# EAGLE design rj45WingEth (EAGLE 9.6.0)
COMPANY: ADAFRUIT INDUSTRIES; DRAWN: KTOWN; REV: B
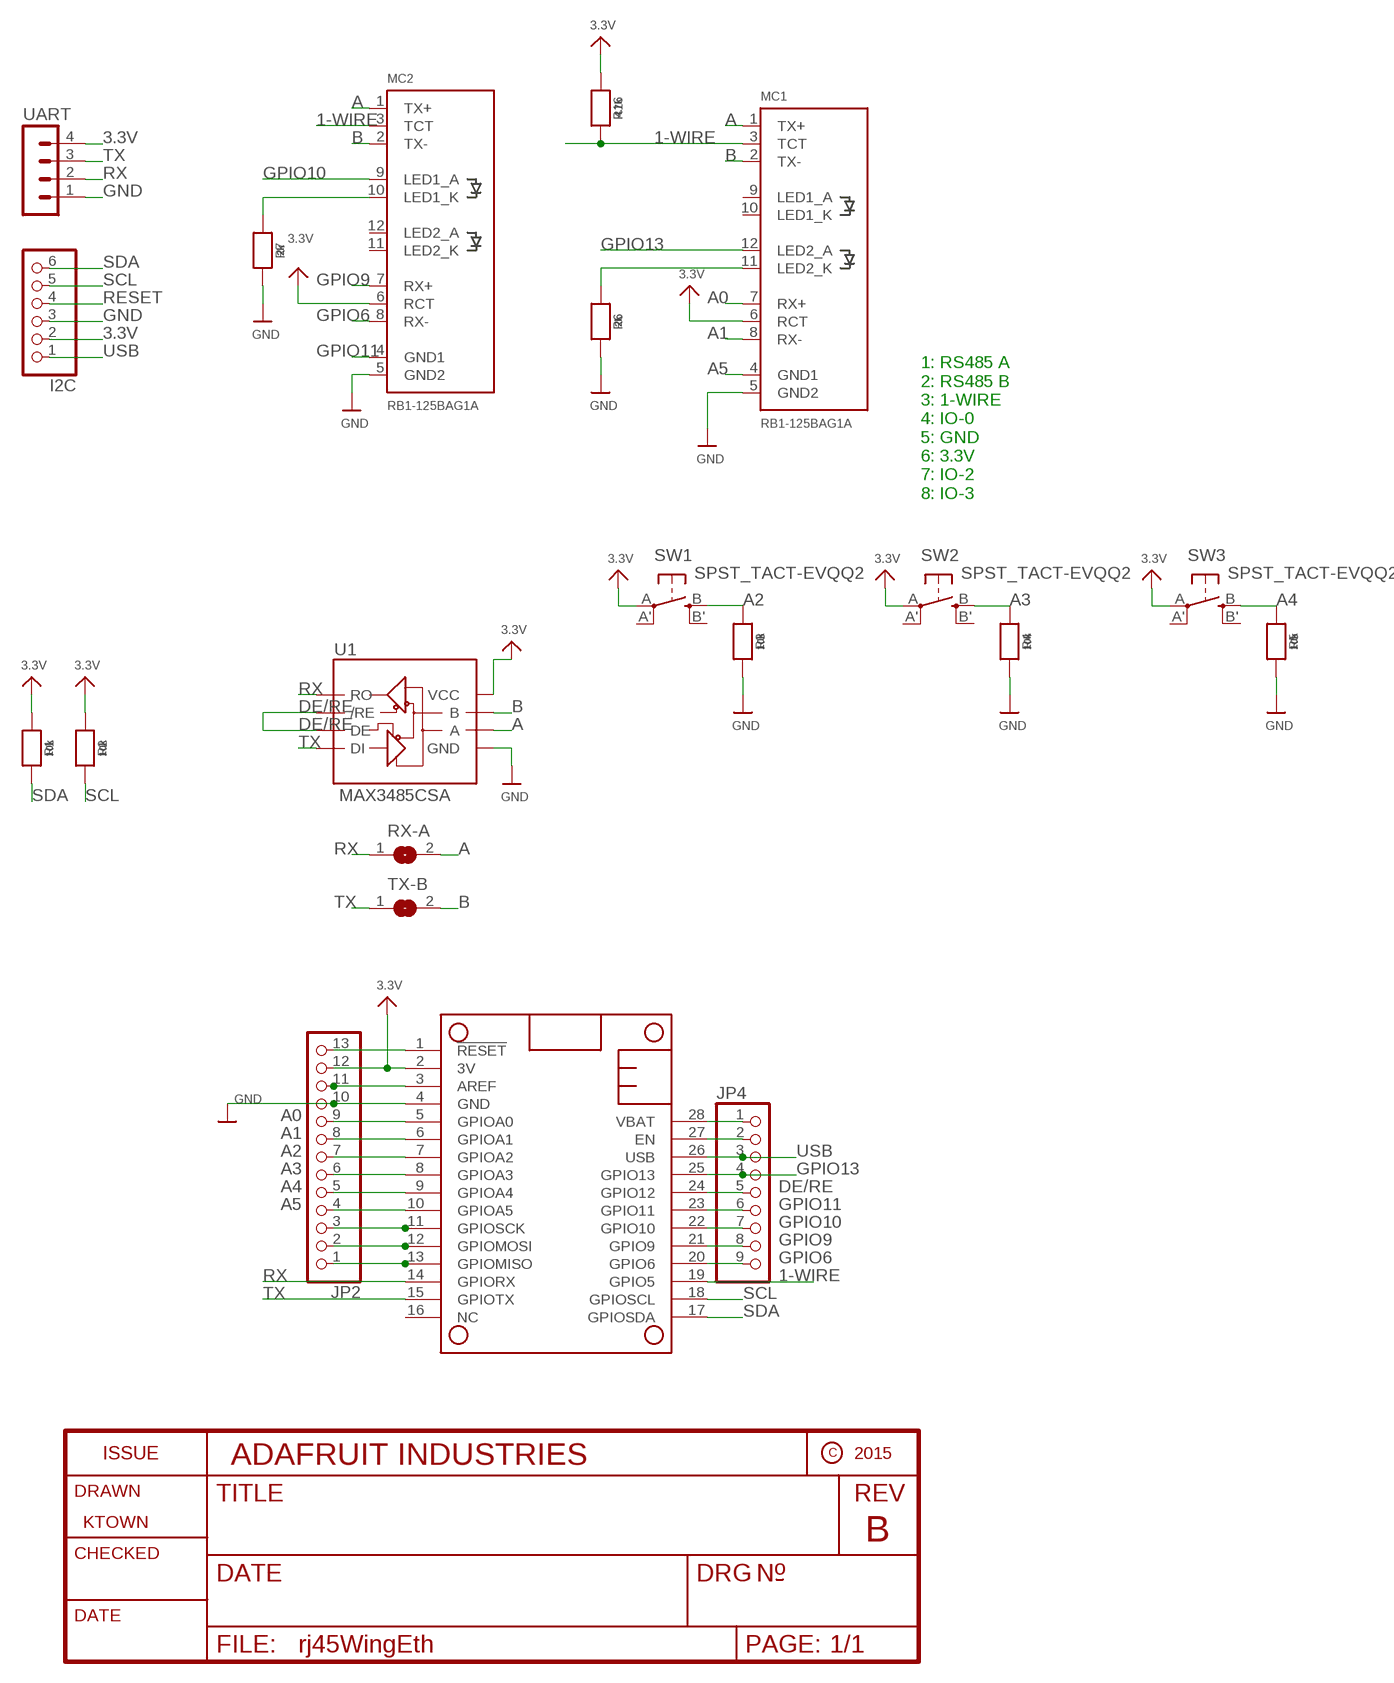
[diagram p0: schematic, sheet 1]

## Parts
I2C  PINHD-1X6  [1X06]
JP2  HEADER-1X13  [1X13_ROUND_70]
JP4  HEADER-1X970MIL  [1X09_ROUND_70]
MC1  RB1-125BAG1A  RJ45J0026D21BNL  [RJ45_PULSEJACK]
MC2  RB1-125BAG1A  RJ45J0026D21BNL  [RJ45_PULSEJACK]
MS1  FEATHERWING_NODIM  [FEATHERWING_NODIM]
R1  10k  RESISTOR_0603_NOOUT  [0603-NO]
R2  10k  RESISTOR_0603_NOOUT  [0603-NO]
R3  10k  RESISTOR_0603_NOOUT  [0603-NO]
R4  10k  RESISTOR_0603_NOOUT  [0603-NO]
R5  10k  RESISTOR_0603_NOOUT  [0603-NO]
R6  2k  RESISTOR_0603_NOOUT  [0603-NO]
R7  2k  RESISTOR_0603_NOOUT  [0603-NO]
R16  4.7k  RESISTOR_0603_NOOUT  [0603-NO]
RX-A  SJ  [SJ]
SW1  SPST_TACT-EVQQ2  [EVQ-Q2]
SW2  SPST_TACT-EVQQ2  [EVQ-Q2]
SW3  SPST_TACT-EVQQ2  [EVQ-Q2]
TX-B  SJ  [SJ]
U1  MAX3485CSA  RS485SOIC  [SO08]
UART  MA04-1  [MA04-1]

## Nets
1-WIRE: MC1.3(TCT) MC2.3(TCT) MS1.19(GPIO5) R16.2
3.3V: I2C.2 JP2.12 MC1.6(RCT) MC2.6(RCT) MS1.2(3V) R1.1 R2.1 R16.1 SW1.A(P) SW2.A(P) SW3.A(P) U1.8(VCC) UART.4
A: MC1.1(TX+) MC2.1(TX+) RX-A.2 U1.6(A)
A0: JP2.9 MC1.7(RX+) MS1.5(GPIOA0)
A1: JP2.8 MC1.8(RX-) MS1.6(GPIOA1)
A2: JP2.7 MS1.7(GPIOA2) R3.1 SW1.B(S)
A3: JP2.6 MS1.8(GPIOA3) R4.1 SW2.B(S)
A4: JP2.5 MS1.9(GPIOA4) R5.1 SW3.B(S)
A5: JP2.4 MC1.4(GND1) MS1.10(GPIOA5)
B: MC1.2(TX-) MC2.2(TX-) TX-B.2 U1.7(B)
DE/RE: JP4.5 MS1.24(GPIO12) U1.2(/RE) U1.3(DE)
GND: I2C.3 JP2.10 MC1.5(GND2) MC2.5(GND2) MS1.4(GND) R3.2 R4.2 R5.2 R6.2 R7.2 U1.5(GND) UART.1
GPIO6: JP4.9 MC2.8(RX-) MS1.20(GPIO6)
GPIO9: JP4.8 MC2.7(RX+) MS1.21(GPIO9)
GPIO10: JP4.7 MC2.9(LED1_A) MS1.22(GPIO10)
GPIO11: JP4.6 MC2.4(GND1) MS1.23(GPIO11)
GPIO13: JP4.4 MC1.12(LED2_A) MS1.25(GPIO13)
MISO_MCU: JP2.1 MS1.13(GPIOMISO)
MOSI: JP2.2 MS1.12(GPIOMOSI)
N$1: MC1.11(LED2_K) R6.1
N$3: MC2.10(LED1_K) R7.1
N$15: JP4.2 MS1.27(EN)
N$22: JP2.13 MS1.1(!RESET)
N$34: JP2.11 MS1.3(AREF)
RESET: I2C.4
RX: MS1.14(GPIORX) RX-A.1 U1.1(RO) UART.2
SCK: JP2.3 MS1.11(GPIOSCK)
SCL: I2C.5 MS1.18(GPIOSCL) R2.2
SDA: I2C.6 MS1.17(GPIOSDA) R1.2
TX: MS1.15(GPIOTX) TX-B.1 U1.4(DI) UART.3
USB: I2C.1 JP4.3 MS1.26(USB)
VBAT: JP4.1 MS1.28(VBAT)
Unconnected: MC1.9(LED1_A) MC1.10(LED1_K) MC2.11(LED2_K) MC2.12(LED2_A) MS1.16(NC) SW1.A'(P1) SW1.B'(S1) SW2.A'(P1) SW2.B'(S1) SW3.A'(P1) SW3.B'(S1)

## Notes on the sheet
- 1: RS485 A
  2: RS485 B
  3: 1-WIRE
  4: IO-0
  5: GND
  6: 3.3V
  7: IO-2
  8: IO-3

## Library data of the parts
I2C = adafruit:PINHD-1X6: PIN HEADER
JP2 = microbuilder:HEADER-1X13
JP4 = microbuilder:HEADER-1X9: PIN HEADER
MC1 MC2 = microbuilder:RJ45: RJ45 (Ethernet) Connectors J0026D21BNL - RJ45 Connector with internal transformer and 2 LEDs (Yellow/Green). LEDs have max foreward-voltage of 2.5V. LEDs require an external resistor. Digikey: 553-1349-ND J00-0065NL - RJ45 Connector with internal transformer and 2 LEDs (Yellow/Green). LEDs have max foreward-voltage of 2.5V. LEDs require an external resistor. Digikey: 553-1345-ND
MS1 = microbuilder:FEATHERWING
R1-R7 R16 = microbuilder:RESISTOR: Resistors For new designs, use the packages preceded by an '_' character since they are more reliable: The following footprints should be used on most boards: _0402 - Standard footprint for regular board layouts _0603 - Standard footprint for regular board layouts _0805 - Standard footprint for regular board layouts _1206 - Standard footprint for regular board layouts For extremely tight-pitch boards where space is at a premium, the following 'micro-pitch' footprints can be used (smaller pads, no silkscreen outline, etc.): _0402MP - Micro-pitch footprint for very dense/compact boards _0603MP - Micro-pitch footprint for very dense/compact boards _0805MP - Micro-pitch footprint for very dense/compact boards _1206MP - Micro-pitch footprint for very dense/compact boards
RX-A TX-B = jumper:SJ: SMD solder JUMPER
SW1-SW3 = adafruit:SPST_TACT: SMT 6mm switch, EVQQ2 series http://www.ladyada.net/library/eagle
U1 = SparkFun-IC-Comms:RS485: RS-485 Transceiver SP3485 Series 8 Pin NSOIC 3.3 V Low Power Half Duplex RS-485 Transceiver MAX3485 compatible Datasheet <http://www.sparkfun.com/datasheets/Components/General/sp3485CN-LTR.pdf> SparkFun Products SparkFun Transceiver Breakout - RS-485 <https://www.sparkfun.com/products/10124> (BOB-10124) SparkFun USB to RS-485 Converter <https://www.sparkfun.com/products/9822> (BOB-09822); PROD_ID: IC-09388
UART = con-lstb:MA04-1: PIN HEADER; OC_FARNELL: unknown; OC_NEWARK: unknown

## Module SO8
Ports: 

### Library data of the parts

## Board
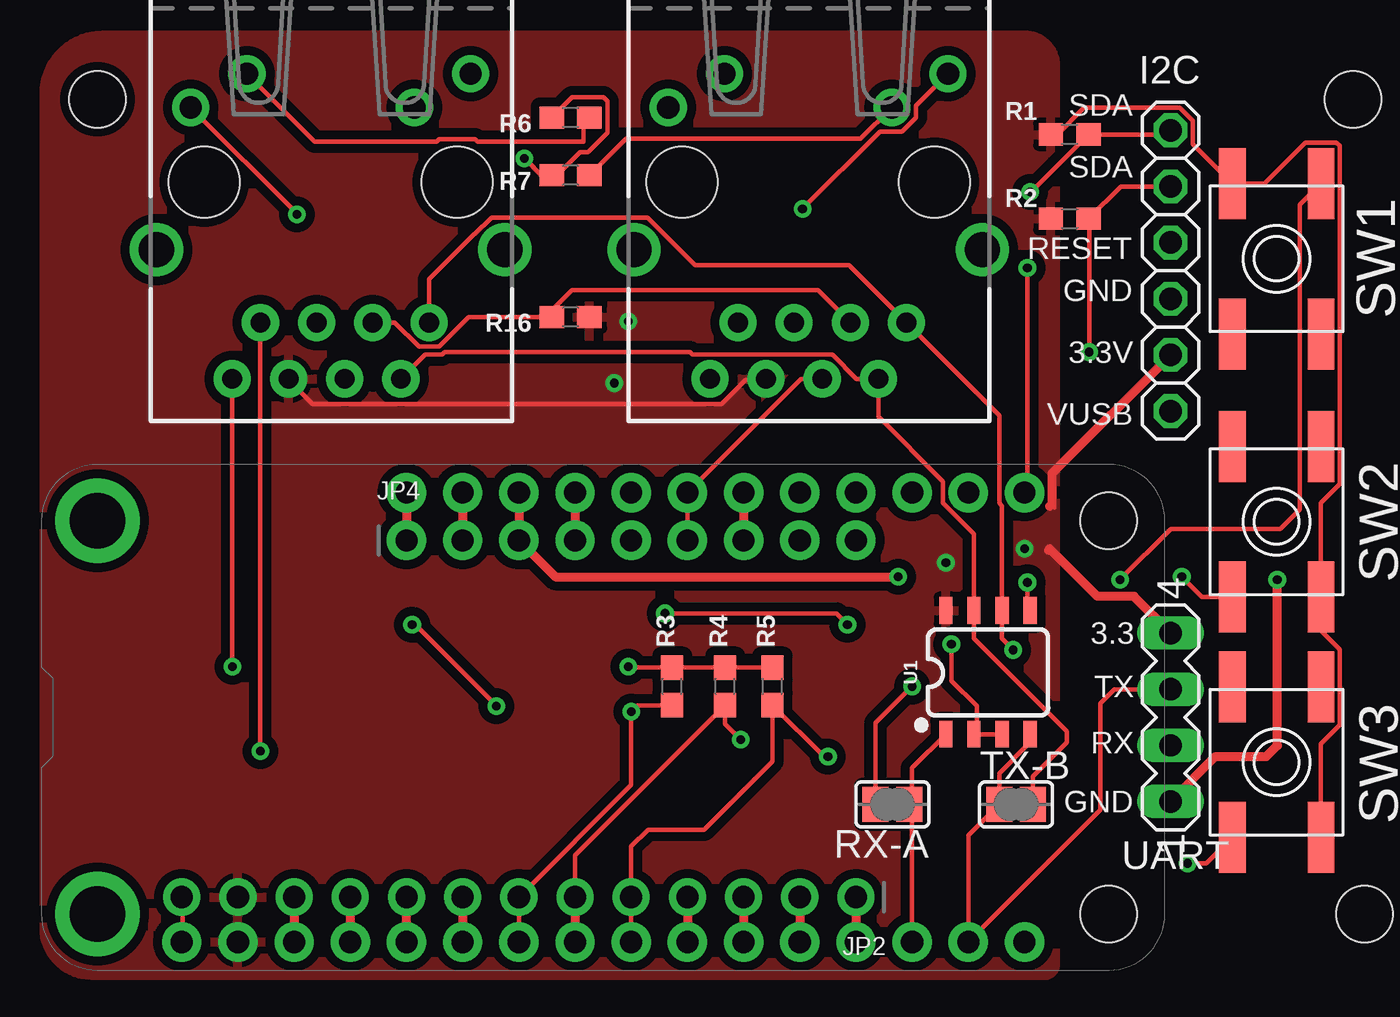
[diagram p1: board, top side]
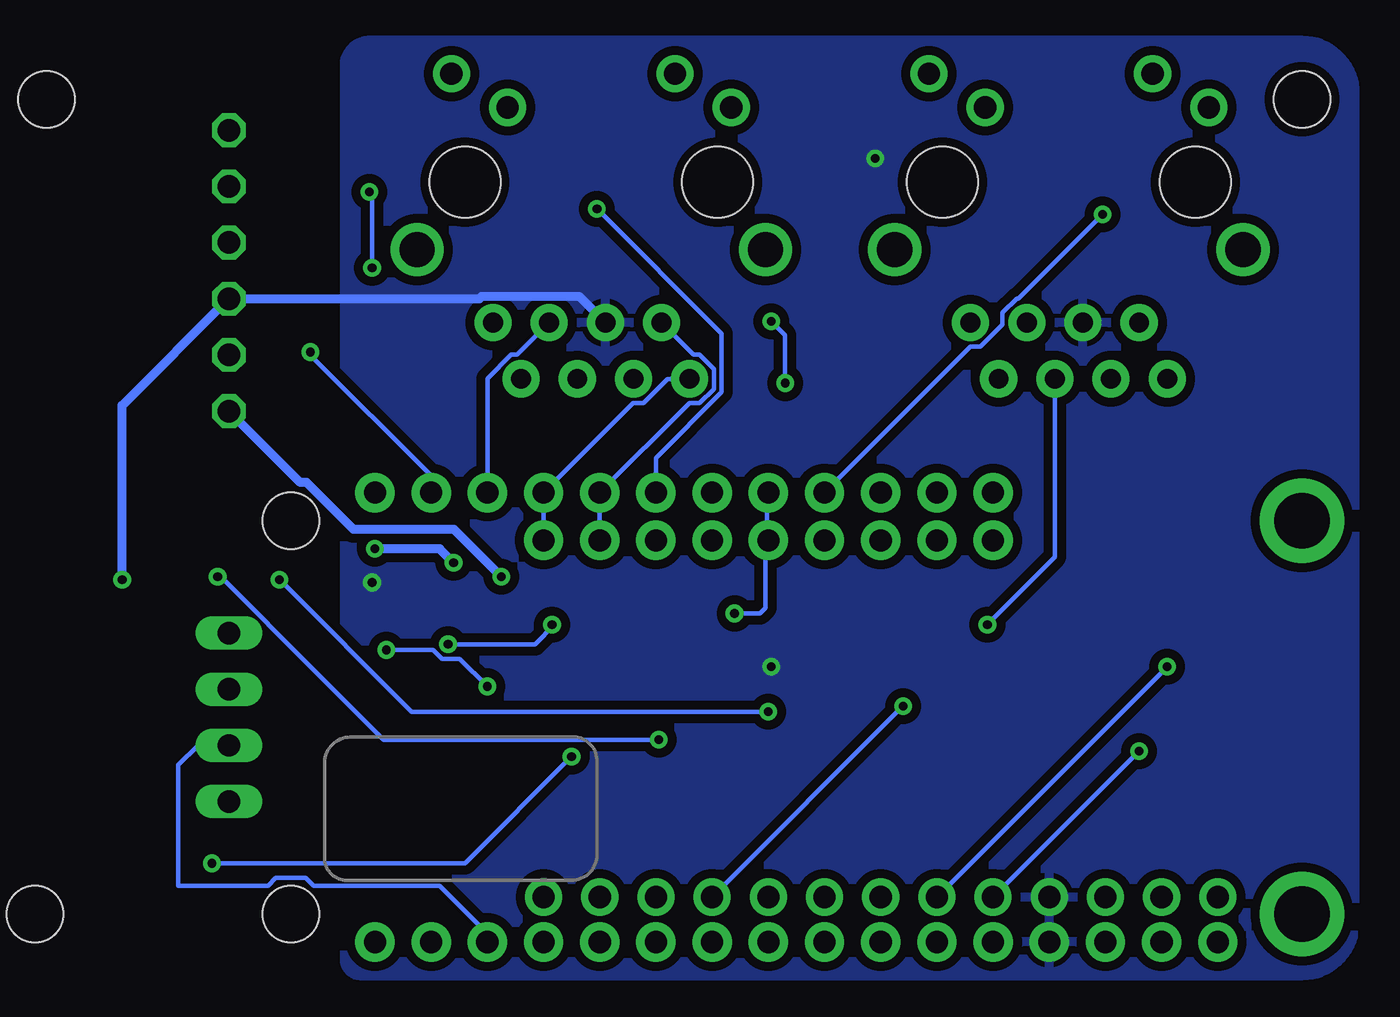
[diagram p2: board, bottom side, seen from below]

No outline drawn. Coordinates in mm, seen from the top.
Copper layers (1*16): Top 0.035mm / dielectric 1.5mm / Bottom 0.035mm
Design rules "adafruit *": minimum track width 8mil, minimum drill 15.5mil, track to track 6mil, track to pad 6mil, pad to pad 6mil, via to via 6mil, smd to smd 6mil, copper to edge 10mil, drill to drill 8mil, minimum pad ring 10mil, minimum via ring 8mil, stop-mask expansion 2mil, vias tented up to drill 20mil, thermal gap 10mil
Holes 2.54 mm at 2.54,39.37 59.31,39.37 59.82,2.54

### Footprints (pad centres in the part's own frame; a part is rotated, then mirrored left to right if it is on the bottom)
1X06 = drill 1.016 octagon: 1 -6.35,0; 2 -3.81,0; 3 -1.27,0; 4 1.27,0; 5 3.81,0; 6 6.35,0
1X13_ROUND_70 = drill 1 pad 1.676: 1 -15.24,0; 2 -12.7,0; 3 -10.16,0; 4 -7.62,0; 5 -5.08,0; 6 -2.54,0; 7 0,0; 8 2.54,0; 9 5.08,0; 10 7.62,0; 11 10.16,0; 12 12.7,0; 13 15.24,0
1X09_ROUND_70 = drill 1 pad 1.778: 1 -10.16,0; 2 -7.62,0; 3 -5.08,0; 4 -2.54,0; 5 0,0; 6 2.54,0; 7 5.08,0; 8 7.62,0; 9 10.16,0
RJ45_PULSEJACK = drill 0.9 pad 1.676: 1 4.445,-6.35; 2 3.175,-8.89; 3 1.905,-6.35; 4 0.635,-8.89; 5 -0.635,-6.35; 6 -1.905,-8.89; 7 -3.175,-6.35; 8 -4.445,-8.89 | drill 1 pad 1.676: 9 6.325,4.9; 10 3.785,3.38; 11 -3.785,4.9; 12 -6.325,3.38 | drill 1.6: P$5 -7.875,-3.05; P$6 7.875,-3.05 | hole 3.2: -5.715,0; 5.715,0
FEATHERWING_NODIM = drill 1 pad 1.778: 1 6.35,1.27; 2 8.89,1.27; 3 11.43,1.27; 4 13.97,1.27; 5 16.51,1.27; 6 19.05,1.27; 7 21.59,1.27; 8 24.13,1.27; 9 26.67,1.27; 10 29.21,1.27; 11 31.75,1.27; 12 34.29,1.27; 13 36.83,1.27; 14 39.37,1.27; 15 41.91,1.27; 16 44.45,1.27; 17 44.45,21.59; 18 41.91,21.59; 19 39.37,21.59; 20 36.83,21.59; 21 34.29,21.59; 22 31.75,21.59; 23 29.21,21.59; 24 26.67,21.59; 25 24.13,21.59; 26 21.59,21.59; 27 19.05,21.59; 28 16.51,21.59 | drill 2.5 pad 3.81: P$1 2.54,20.32; P$2 2.54,2.54 | hole 2.54: 48.26,20.32; 48.26,2.54
0603-NO = smd 1.1 x 1: 1 -0.85,0; 2 0.85,0
SJ = smd 1.168 x 1.6: 1 -0.762,0; 2 0.762,0
EVQ-Q2 = smd 3.2 x 1.2: A -3.4,-2; A' 3.4,-2; B -3.4,2; B' 3.4,2
SO08 = smd 0.6 x 1.2: 1 -1.905,-2.8; 2 -0.635,-2.8; 3 0.635,-2.8; 4 1.905,-2.8; 5 1.905,2.8; 6 0.635,2.8; 7 -0.635,2.8; 8 -1.905,2.8
MA04-1 = drill 1.016 long: 1 -3.81,0; 2 -1.27,0; 3 1.27,0; 4 3.81,0

### Placement (x,y rotation side)
I2C  51.05,31.62 90 top
JP2  21.59,3.3 180 top
JP4  26.67,19.43 0 top
MC1  13.08,35.62 0 top
MC2  34.67,35.62 0 top
MS1  0,0 0 top
R1  46.49,37.78 0 top
R2  46.49,33.97 0 top
R3  28.52,12.83 90 top
R4  30.92,12.83 90 top
R5  33.06,12.83 90 top
R6  23.93,38.54 180 top
R7  23.93,35.94 180 top
R16  23.93,29.53 180 top
RX-A  38.48,7.49 180 top
SW1  55.85,32.16 270 top
SW2  55.85,20.27 90 top
SW3  55.85,9.4 90 top
TX-B  44.07,7.49 0 top
U1  42.8,13.46 0 top
UART  51.05,11.43 90 top

### Tracks (layer width: path | path; a pad name or v marks a point on that pad's centre or on a via)
1-WIRE
  Top 0.203: MC2.3 35.12,30.73 24,30.73 23.08,29.81 R16.2 19.32,29.53 17.98,28.18 17.07,28.18 15.98,29.27 MC1.3
  Bottom 0.203: MC2.3 38.02,27.83 38.3,27.83 39.37,26.75 MS1.19
3.3V  (via drill 0.39)
  Top 0.203: SW3.A 57.85,10.24 58.7,11.09 58.7,14.5 57.85,15.36 SW2.A 57.85,21.11 58.7,21.97 58.7,37.27 58.55,37.42 57.14,37.42 55.29,35.56 SW1.A 52.07,37.34 52.07,38.39 51.48,38.99 47.14,38.99 45.93,37.78 R1.1 | 32.7,26.67 31.83,26.67 30.76,25.6 12.27,25.6 11.2,26.67 MC1.6 | 32.7,26.67 32.72,26.67 | 32.7,26.67 MC2.6 | 45.8,20.92 45.72,20.95 45.7,21.07
  Top 0.406: UART.4 49.4,16.9 47.75,16.9 45.59,19.05 45.53,18.99 | 45.59,20.97 45.7,21.07 45.7,22.45 I2C.2
  Bottom 0.203: v25.91,26.54 25.91,28.7 v26.54,29.34
  Bottom 0.406: v40.89,18.41 41.53,19.05 v44.45,19.05
  pour Top (isolate 0.406): 0.13,39.62 arc-90 2.79,42.29 44.45,42.29 arc-90 45.85,40.89 45.85,0.25 arc-90 45.34,-0.25 2.29,-0.25 arc-90 0.13,1.91
A  (via drill 0.39)
  Top 0.203: RX-A.2 37.72,11.18 v39.37,12.83 | v43.94,14.48 43.43,14.99 U1.6 43.43,20.99 43.31,21.12 43.31,25.08 MC2.1 36.51,31.88 29.55,31.88 27.4,34.03 20.35,34.03 19.6,33.27 19.56,33.27 17.53,31.24 MC1.1
  Bottom 0.203: 17.53,29.46 MC1.1 | v39.37,12.83 40.62,14.08 41.42,14.08 41.82,14.48 v43.94,14.48
A0  (via drill 0.39)
  Top 0.203: MC1.7 v9.91,9.91
  Top 0.406: MS1.5 JP2.9
  Bottom 0.203: JP2.9 v9.91,9.91
A1  (via drill 0.39)
  Top 0.203: MC1.8 v8.64,13.72
  Top 0.406: JP2.8 MS1.6
  Bottom 0.203: v8.64,13.72 JP2.8
A2  (via drill 0.39)
  Top 0.203: SW1.B 56.9,34.61 56.9,20.83 56.01,19.94 51.05,19.94 v48.77,17.65 | R3.1 26.96,11.98 v26.67,11.68 26.67,8.38 JP2.7 MS1.7
  Bottom 0.203: v48.77,17.65 42.8,11.68 v26.67,11.68
A3  (via drill 0.39)
  Top 0.203: SW2.B 52.47,16.87 v51.56,17.78 | v31.62,10.41 30.91,11.12 R4.1 24.13,5.19 JP2.6
  Top 0.406: JP2.6 MS1.8
  Bottom 0.203: v51.56,17.78 51.4,17.78 49.28,15.66 49.28,15.62 44.07,10.41 v31.62,10.41
A4  (via drill 0.39)
  Top 0.203: SW3.B 52.67,4.83 v51.82,4.83 51.69,4.83 | v35.56,9.65 35.38,9.65 R5.1 33.06,9.43 29.97,6.35 27.43,6.35 26.67,5.59 JP2.5 MS1.9
  Bottom 0.203: v51.82,4.83 40.39,4.83 v35.56,9.65
A5  (via drill 0.39)
  Top 0.203: v20.57,11.94 16.89,15.62 v16.76,15.62
  Top 0.406: JP2.4 MS1.10
  Bottom 0.203: JP2.4 v20.57,11.94 | v16.76,15.62 13.72,18.67 MC1.4
B
  Top 0.203: TX-B.2 44.83,8.76 46.35,10.29 46.35,10.79 42.16,14.99 U1.7 42.16,19.72 40.77,21.12 40.77,22.1 37.85,25.02 MC2.2 36.85,26.73 35.76,27.83 29.45,27.83 29.34,27.94 18.24,27.94 18.13,27.83 17.35,27.83 MC1.2
DE/RE  (via drill 0.39)
  Top 0.203: 42.23,10.73 42.29,10.79 42.29,11.94 41.15,13.08 v41.15,14.73 | 42.23,10.73 U1.2 | U1.3 42.3,10.66 42.23,10.73 | v28.19,16.13 35.94,16.13 v36.45,15.62
  Bottom 0.203: JP4.5 26.73,19.37 | 26.73,19.37 26.8,19.3 26.8,16.38 27.05,16.13 v28.19,16.13 | v41.15,14.73 37.21,14.73 36.32,15.62 v36.45,15.62 | MS1.24 26.73,21.53 26.73,19.37
GND  (via drill 0.39)
  Top 0.203: R5.2 R4.2 | R4.2 | R4.2 R3.2 26.58,13.68 v26.54,13.72 | U1.5 44.58,16.39 v44.58,17.53 | 23.11,36.09 23.47,36.09 23.53,36.16 | 23.53,36.16 24.36,36.98 24.71,36.98 25.6,37.87 25.6,39.29 25.43,39.47 24,39.47 23.22,38.69 | 23.11,38.58 23.22,38.69 | 22.28,36.27 v21.84,36.7 22.61,35.94 R7.2 23.18,36.2 23.5,36.2 23.53,36.16 | R6.2 23.18,38.73 23.22,38.69
  Top 0.406: JP2.10 MS1.4 | UART.1 53.09,9.65 55.37,9.65 55.88,10.16 v55.88,17.65
  Bottom 0.203: MC2.5 34.14,29.34 34.01,29.25
  Bottom 0.406: MC2.5 35.23,30.47 39.61,30.47 39.73,30.35 I2C.3 55.88,25.53 v55.88,17.65
  pour Bottom (isolate 0.406): 0.13,39.62 arc-90 2.54,42.04 44.7,42.04 arc-90 45.85,40.89 45.85,0.51 arc-90 45.09,-0.25 2.54,-0.25 arc-90 0.13,2.16
GPIO6
  Bottom 0.203: MC2.8 31.22,26.73 32.31,25.64 32.78,25.64 MS1.20 JP4.9
GPIO9
  Bottom 0.203: MC2.7 30.05,27.83 29.77,27.83 29.13,27.19 29.13,26.28 29.77,25.64 30.24,25.64 MS1.21 JP4.8
GPIO10  (via drill 0.39)
  Top 0.203: v34.42,34.42 37.91,37.91 38.91,37.91 39.55,38.55 39.55,39.08 MC2.9
  Top 0.406: MS1.22 JP4.7
  Bottom 0.203: MS1.22 31.75,23.16 28.78,26.13 28.78,28.78 v34.42,34.42
GPIO11
  Top 0.203: MC2.4 34.35,26.73 MS1.23 JP4.6
GPIO13  (via drill 0.39)
  Top 0.203: MC1.12 11.56,34.2 v11.56,34.16
  Top 0.406: MS1.25 JP4.4
  Bottom 0.203: MS1.25 17.54,28.18 17.07,28.18 16.08,29.18 16.08,29.73 15.44,30.37 15.35,30.37 v11.56,34.16
MISO_MCU
  Top 0.406: JP2.1 MS1.13
MOSI
  Top 0.406: JP2.2 MS1.12
N$1
  Top 0.203: R6.1 24.51,38.27 24.51,37.47 19.72,37.47 19.61,37.58 17.99,37.58 17.87,37.47 12.35,37.47 MC1.11
N$3
  Top 0.203: R7.1 26.43,37.59 37.04,37.59 MC2.10
N$15
  Top 0.406: MS1.27 JP4.2
N$22
  Top 0.203: JP2.13 6.4,3.2 6.4,1.42 MS1.1
N$34
  Top 0.406: JP2.11 MS1.3
RX
  Top 0.203: MS1.14 39.37,7.62 | U1.1 39.37,9.14 39.37,7.62 | RX-A.1 39.37,7.62
  Bottom 0.203: UART.2 52.45,10.16 53.34,9.27 53.34,3.81 49.29,3.81 48.93,4.17 47.59,4.17 47.23,3.81 41.53,3.81 39.37,1.65 MS1.14
SCK
  Top 0.406: JP2.3 MS1.11
SCL  (via drill 0.39)
  Top 0.203: v47.37,27.94 47.37,33.94 R2.2 48.8,35.43 I2C.5
  Bottom 0.203: MS1.18 41.91,22.35 47.37,27.81 v47.37,27.94
SDA  (via drill 0.39)
  Top 0.203: I2C.6 50.86,37.78 R1.2 44.74,35.18 v44.7,35.18 | v44.58,31.75 44.58,21.72 MS1.17
  Bottom 0.203: v44.7,35.18 44.58,35.05 v44.58,31.75
TX
  Top 0.203: U1.4 44.7,10.29 43.31,8.89 TX-B.1 41.91,6.1 MS1.15 47.88,7.24 47.88,12.06 48.51,12.7 UART.3
USB  (via drill 0.39)
  Top 0.406: MS1.26 JP4.3 23.24,17.78 v38.73,17.78
  Bottom 0.406: I2C.1 47.83,22.05 47.55,22.05 45.44,19.94 40.89,19.94 v38.73,17.78
VBAT
  Top 0.406: MS1.28 JP4.1

### Text on the board
tNames: SDA | SDA | RESET | GND | SW1 | 3.3V | VUSB | SW2 | 3.3 | TX | RX | GND | SW3
bDocu: Uart --> Rj45 (No 485)